# Altium project 001_project.PrjPcb
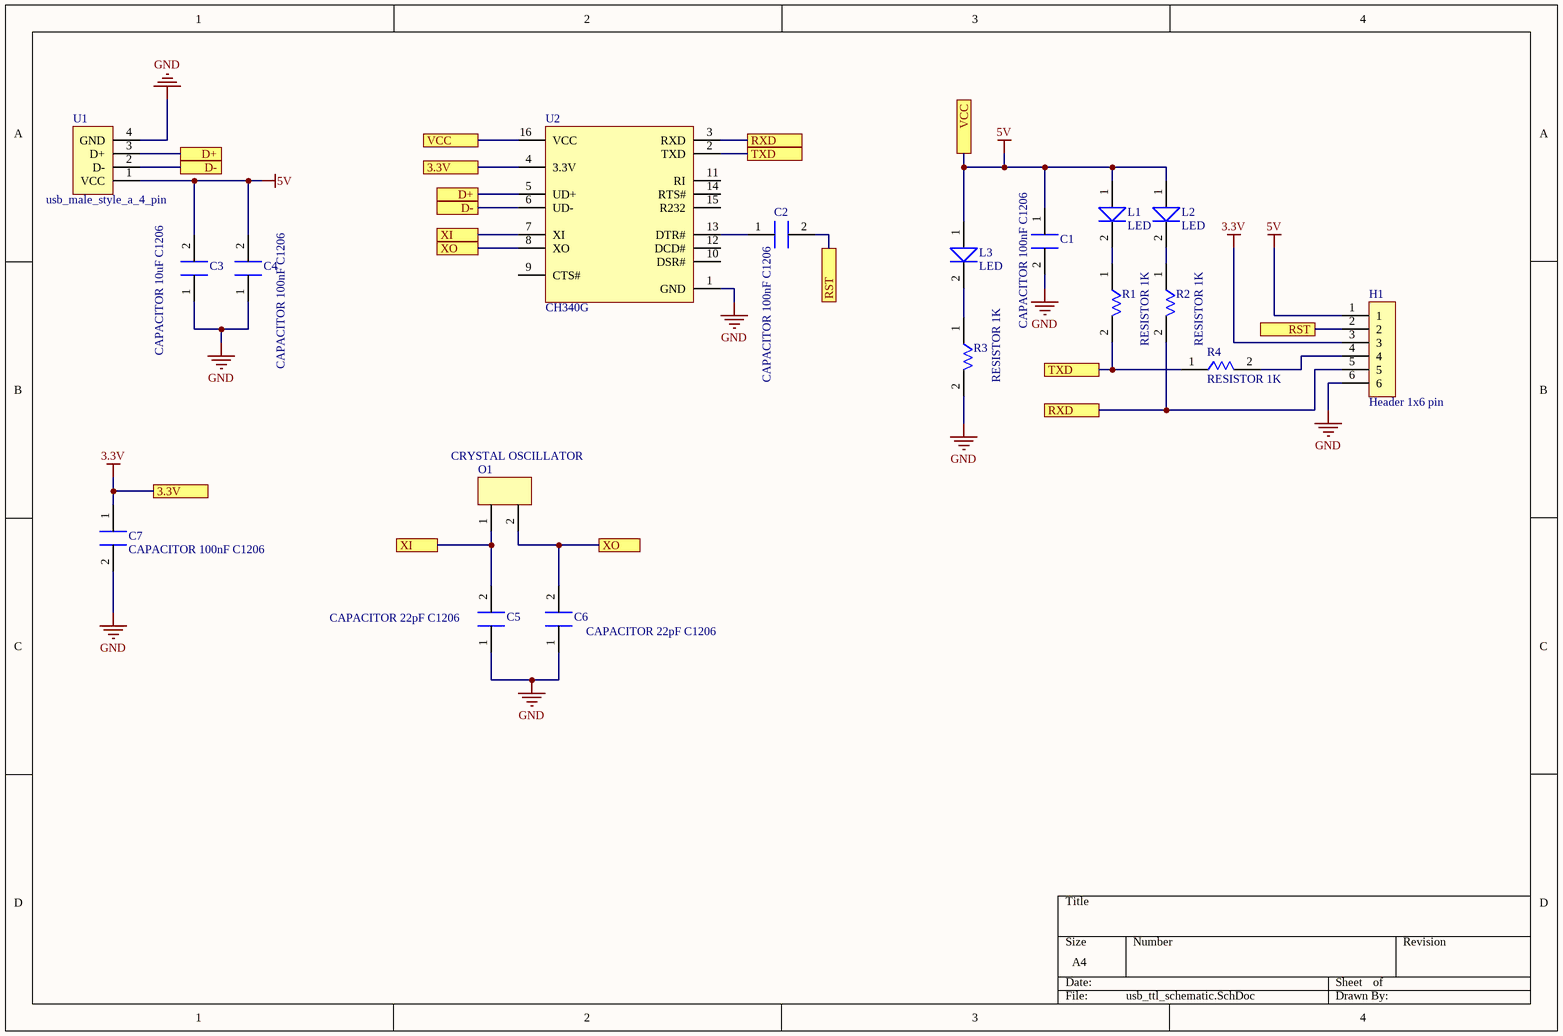
[diagram p0: usb_ttl_schematic.SchDoc]
1 sheet, 18 parts. Net scope: flat (ports and power ports of the same name join across sheets).
Board file: usb_ttl_pcb.PcbDoc

## Sheet usb_ttl_schematic.SchDoc
size A4; SheetNumber: 1; SheetTotal: 1

### Parts
C1  CAPACITOR 100nF C1206  [CAPACITOR C1206]
C2  CAPACITOR 100nF C1206  [CAPACITOR C1206]
C3  CAPACITOR 10uF C1206  [CAPACITOR C1206]
C4  CAPACITOR 100nF C1206  [CAPACITOR C1206]
C5  CAPACITOR 22pF C1206  [CAPACITOR C1206]
C6  CAPACITOR 22pF C1206  [CAPACITOR C1206]
C7  CAPACITOR 100nF C1206  [CAPACITOR C1206]
H1  Header 1x6 pin  [header 1x6]
L1  LED  [led]
L2  LED  [led]
L3  LED  [led]
O1  CRYSTAL OSCILLATOR  [CRYSTAL OSC.]
R1  RESISTOR 1K  [RESISTOR 1K]
R2  RESISTOR 1K  [RESISTOR 1K]
R3  RESISTOR 1K  [RESISTOR 1K]
R4  RESISTOR 1K  [RESISTOR 1K]
U1  usb_male_style_a_4_pin  [usb_style a_male 4_contact]
U2  CH340G  [CH340G]

### Ports
3.3V (see usb_ttl_schematic[1B]), 3.3V (see usb_ttl_schematic[2A]), D+ (see usb_ttl_schematic[1A]), D+ (see usb_ttl_schematic[2A]), D- (see usb_ttl_schematic[1A]), D- (see usb_ttl_schematic[2A]), RST (see usb_ttl_schematic[3B]), RST (see usb_ttl_schematic[4B]), RXD (see usb_ttl_schematic[2A]), RXD (see usb_ttl_schematic[3B]), TXD (see usb_ttl_schematic[2A]), TXD (see usb_ttl_schematic[3B]), VCC (see usb_ttl_schematic[2A]), VCC (see usb_ttl_schematic[3A]), XI (see usb_ttl_schematic[2A]), XI (see usb_ttl_schematic[2C]), XO (see usb_ttl_schematic[2A]), XO (see usb_ttl_schematic[2C])

### Nets
3.3V: C7.1 H1.3 U2.4(3.3V) ; port 3.3V
5V: C1.1 C3.2 C4.2 H1.1 L1.1 L2.1 L3.1 U1.1(VCC) U2.16(VCC) ; port VCC
GND: C1.2 C3.1 C4.1 C5.1 C6.1 C7.2 H1.6 R3.2 U1.4(GND) U2.1(GND)
NetC2_1: C2.1 U2.13(DTR#)
NetC2_2: C2.2 H1.2 ; port RST
NetC5_2: C5.2 O1.1 U2.7(XI) ; port XI
NetC6_2: C6.2 O1.2 U2.8(XO) ; port XO
NetH1_4: H1.4 R4.2
NetH1_5: H1.5 R2.2 U2.3(RXD) ; port RXD
NetL1_2: L1.2 R1.1
NetL2_2: L2.2 R2.1
NetL3_2: L3.2 R3.1
NetR1_2: R1.2 R4.1 U2.2(TXD) ; port TXD
NetU1_2: U1.2(D-) U2.6(UD-) ; port D-
NetU1_3: U1.3(D+) U2.5(UD+) ; port D+

Not connected (* = marked no-connect by the designer): U2 9(CTS#) 10(DSR#) 11(RI) 12(DCD#) 14(RTS#) 15(R232)

### Library data of the parts
C1 C2 C4 C7 = CAPACITOR 100nF C1206: CAP 100nF C1206
C3 = CAPACITOR 10uF C1206: CAP 10 uF C1206
C5 C6 = CAPACITOR 22pF C1206: CAP 22pF C1206
H1 = Header 1x6 pin: header 1x6 pim ,2.54 pin gap
O1 = CRYSTAL OSCILLATOR: HC49 ,CRYSTAL OSCILLATOR 12MHz
U1 = usb_male_style_a_4_pin: USB 4 PIN ,STYLE A,MALE
U2 = CH340G: CH320G ,USB_TO_TTL CONVERTER